# EAGLE design schema actuator (EAGLE 6.4)
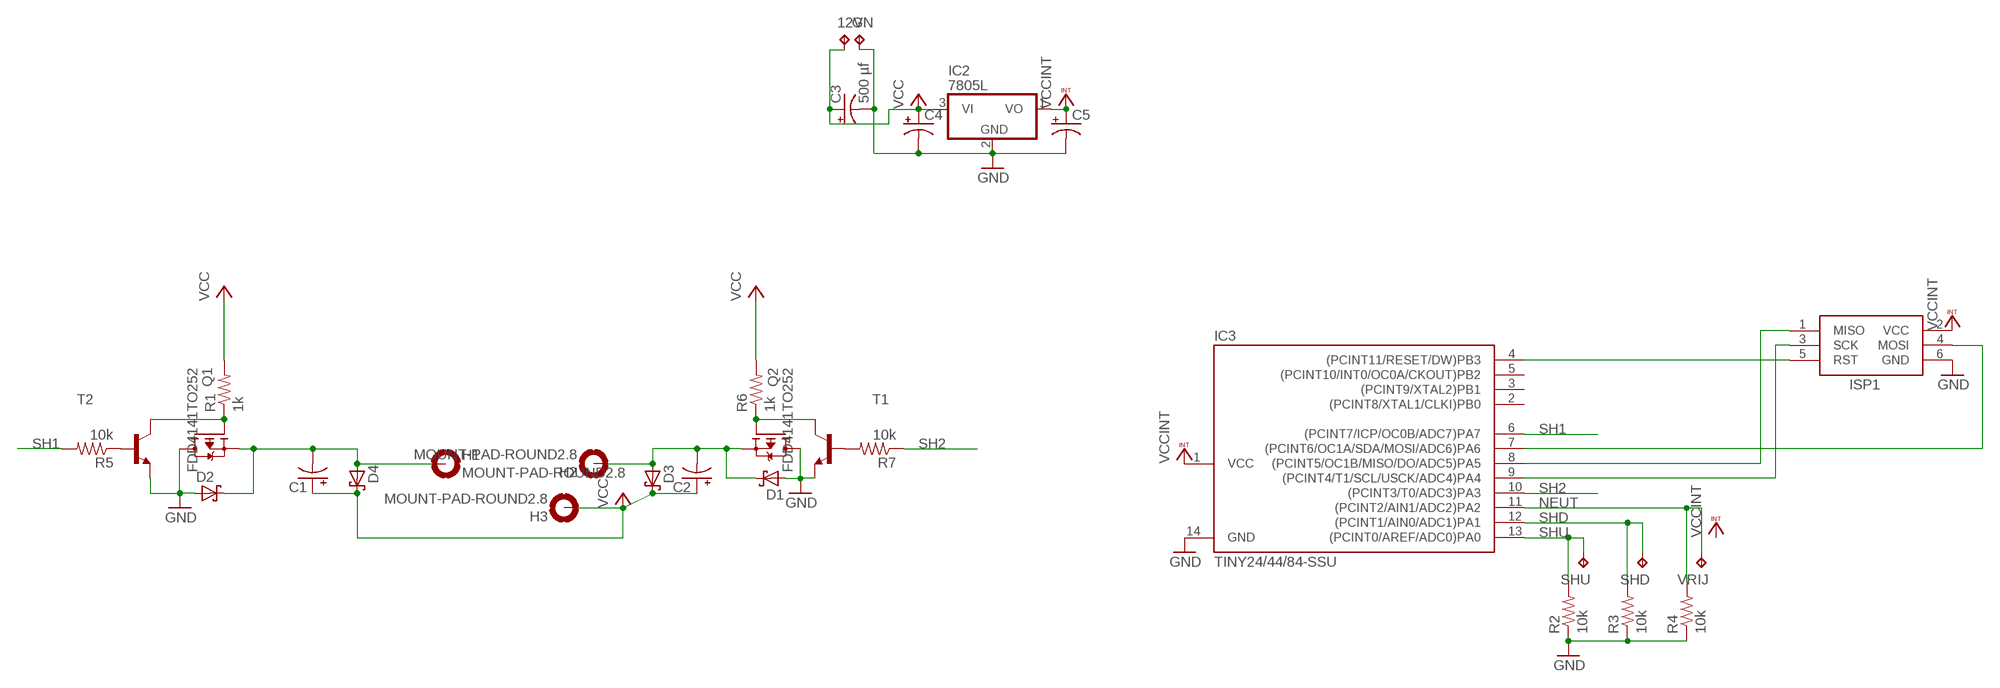
[diagram p0: schematic, sheet 1]

## Parts
12V  TPPAD1-20Y  [P1-20Y]
C1  CPOL-USD  [PANASONIC_D]
C2  CPOL-USD  [PANASONIC_D]
C3  500 µf  CPOL-USG  [PANASONIC_G]
C4  CPOL-USD  [PANASONIC_D]
C5  CPOL-USD  [PANASONIC_D]
D1  SCHOTTKY-DIODEDO41  [DO41-10]
D2  SCHOTTKY-DIODEDO41  [DO41-10]
D3  SCHOTTKY-DIODEDO41  [DO41-10]
D4  SCHOTTKY-DIODEDO41  [DO41-10]
GN  TPPAD1-20Y  [P1-20Y]
H1  MOUNT-PAD-ROUND2.8  [2,8-PAD]
H2  MOUNT-PAD-ROUND2.8  [2,8-PAD]
H3  MOUNT-PAD-ROUND2.8  [2,8-PAD]
IC2  7805L  [TO92]
IC3  TINY24/44/84-SSU  [SOIC14]
ISP1  AVRISP-6  [AVRISP]
Q1  FDD4141TO252  [TO252]
Q2  FDD4141TO252  [TO252]
R1  1k  R-US_R1206  [R1206]
R2  10k  R-US_R1206  [R1206]
R3  10k  R-US_R1206  [R1206]
R4  10k  R-US_R1206  [R1206]
R5  10k  R-US_R1206  [R1206]
R6  1k  R-US_R1206  [R1206]
R7  10k  R-US_R1206  [R1206]
SHD  TPPAD1-20Y  [P1-20Y]
SHU  TPPAD1-20Y  [P1-20Y]
T1  BC817-40-NPN-SOT23-BEC  [SOT23-BEC]
T2  BC817-40-NPN-SOT23-BEC  [SOT23-BEC]
VRIJ  TPPAD1-20Y  [P1-20Y]

## Nets
GND: C3.- C4.- C5.- D1.A D2.A GN.TP IC2.2(GND) IC3.14(GND) ISP1.6(GND) Q1.3(D) Q2.3(D) R2.1 R3.1 R4.1 T1.E T2.E
N$1: C2.- D1.C D3.A H2.B2,8(MOUNT) Q2.2(S)
N$2: Q1.1(G) R1.1 T2.C
N$3: Q2.1(G) R6.1 T1.C
N$4: R5.1 T2.B
N$5: C1.- D2.C D4.A H1.B2,8(MOUNT) Q1.2(S)
N$6: R7.2 T1.B
N$8: IC3.7((PCINT6/OC1A/SDA/MOSI/ADC6)PA6) ISP1.4(MOSI)
N$10: IC3.4((PCINT11/RESET/DW)PB3) ISP1.5(RST)
N$11: IC3.9((PCINT4/T1/SCL/USCK/ADC4)PA4) ISP1.3(SCK)
N$12: IC3.8((PCINT5/OC1B/MISO/DO/ADC5)PA5) ISP1.1(MISO)
NEUT: IC3.11((PCINT2/AIN1/ADC2)PA2) R4.2 VRIJ.TP
SH1: IC3.6((PCINT7/ICP/OC0B/ADC7)PA7) R5.2
SH2: IC3.10((PCINT3/T0/ADC3)PA3) R7.1
SHD: IC3.12((PCINT1/AIN0/ADC1)PA1) R3.2 SHD.TP
SHU: IC3.13((PCINT0/AREF/ADC0)PA0) R2.2 SHU.TP
VCC: 12V.TP C1.+ C2.+ C3.+ C4.+ D3.C D4.C H3.B2,8(MOUNT) IC2.3(VI) R1.2 R6.2
VCCINT: C5.+ IC2.1(VO) IC3.1(VCC) ISP1.2(VCC)
Unconnected: IC3.2((PCINT8/XTAL1/CLKI)PB0) IC3.3((PCINT9/XTAL2)PB1) IC3.5((PCINT10/INT0/OC0A/CKOUT)PB2)

## Library data of the parts
12V GN SHD SHU VRIJ = testpad:TP: Test pad
C1-C5 = adafruit:CPOL-US: POLARIZED CAPACITOR, American symbol
D1-D4 = adafruit:SCHOTTKY-DIODE: Schottky Diode
H1-H3 = holes:MOUNT-PAD-ROUND: MOUNTING PAD, round
IC2 = adafruit:78*: Positive VOLTAGE REGULATOR Added bigger pads to the TO-92 package
IC3 = avr-7:TINY24/44/84
ISP1 = adafruit:AVRISP: AVR ISP HEADER Standard 6 pin header for AVR programming
Q1 Q2 = transistor-fet:FDD4141: P-Channel PowerTrench® MOSFET Source: FDD4141.pdf
R1-R7 = adafruit:R-US_: RESISTOR, American symbol
T1 T2 = transistor:*-NPN-: NPN Transistror BF959 corrected 2008.03.06

## Board
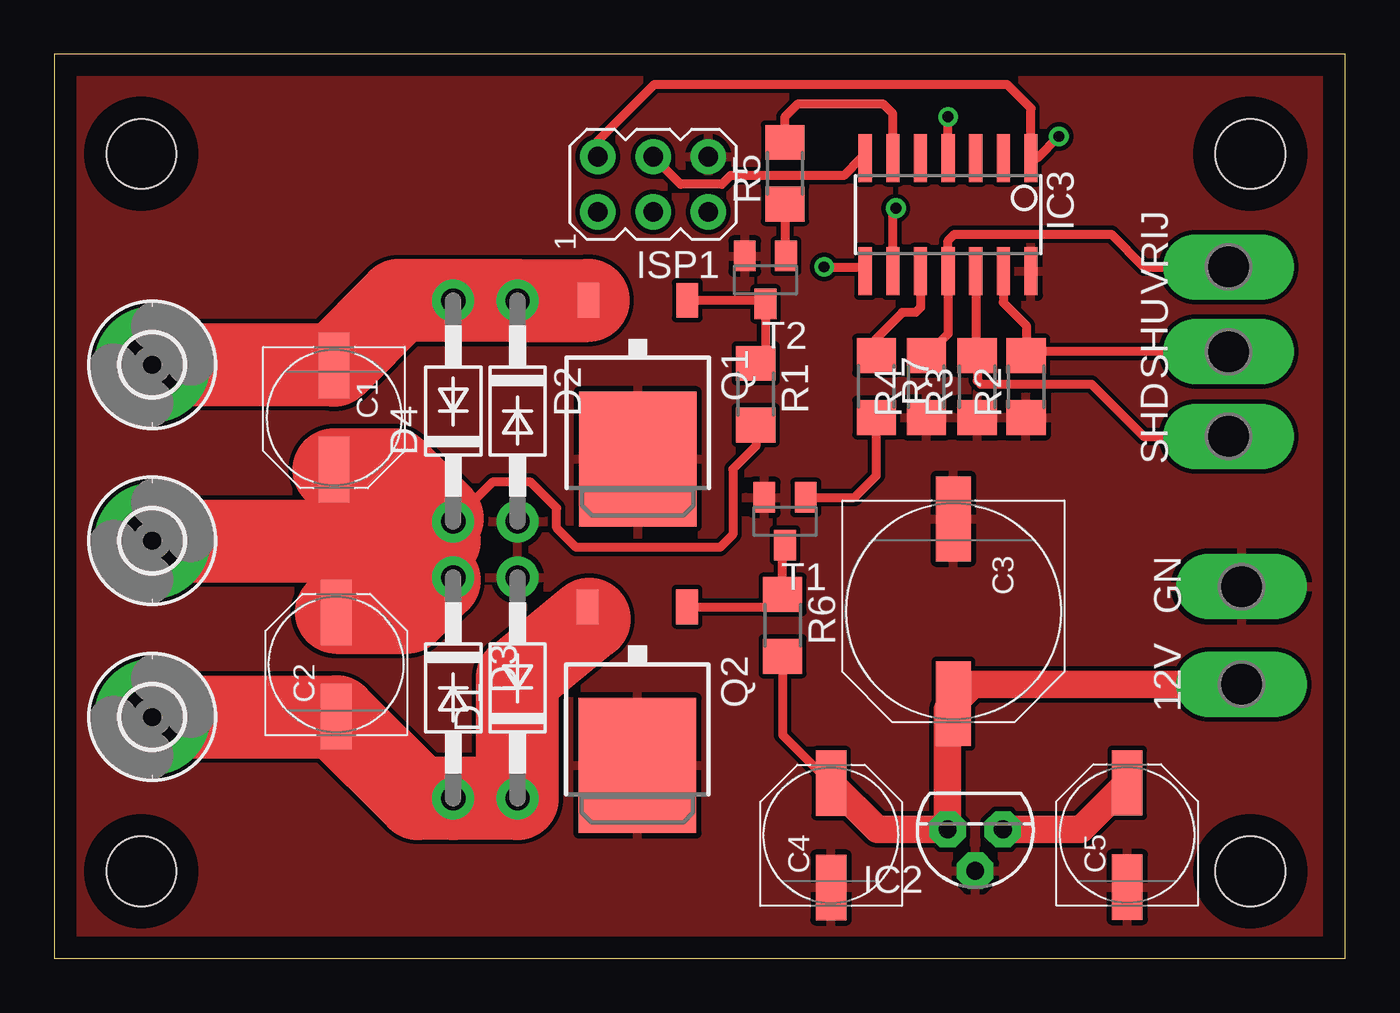
[diagram p1: board, top side]
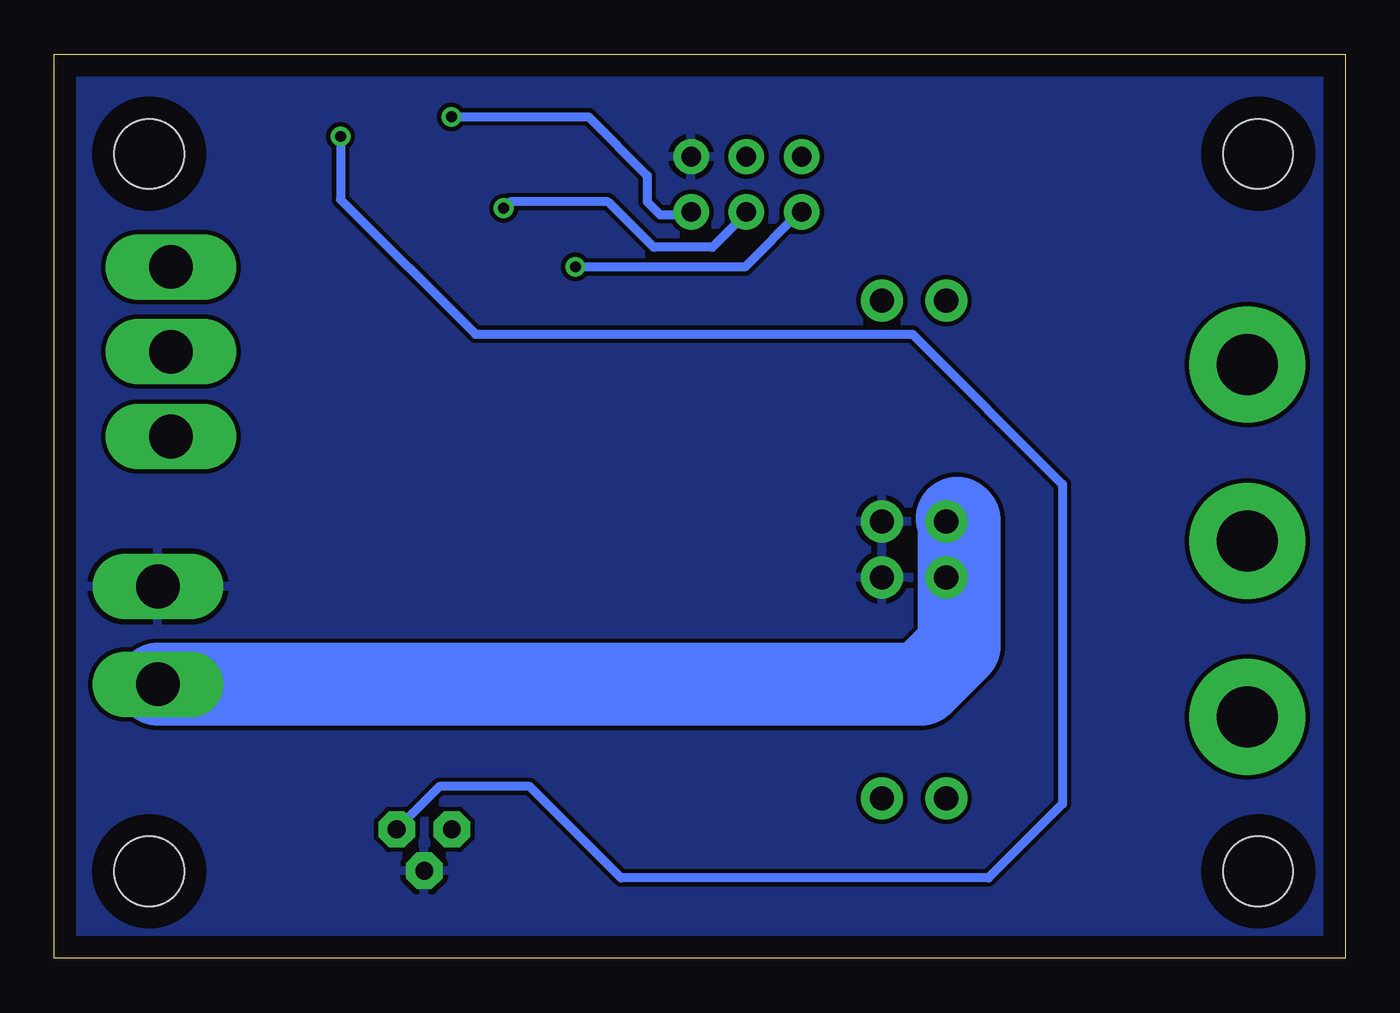
[diagram p2: board, bottom side, seen from below]

Size 59.36 x 41.58 mm. Coordinates in mm from the lower left corner, seen from the top.
Outline: 0,0 59.36,0 59.36,41.58 0,41.58 0,0
Copper layers (1*16): Top 0.035mm / dielectric 1.5mm / Bottom 0.035mm
Design rules "default *": minimum track width 10mil, minimum drill 10mil, track to track 8mil, track to pad 8mil, pad to pad 8mil, via to via 8mil, smd to smd 8mil, copper to edge 40mil, drill to drill 8mil, minimum pad ring 10mil, minimum via ring 8mil, stop-mask expansion 4mil, vias tented up to drill 0mil, thermal gap 10mil
Holes 3.2 mm at 4,37 4,4 55,4 55,37

### Footprints (pad centres in the part's own frame; a part is rotated, then mirrored left to right if it is on the bottom)
P1-20Y = drill 2.007 pad 2.54 long: TP 0,0
PANASONIC_D = smd 3 x 1.4: + 2.4,0; - -2.4,0
PANASONIC_G = smd 3.9 x 1.6: + 4.25,0; - -4.25,0
DO41-10 = drill 1.118 pad 1.93: A 5.08,0; C -5.08,0
2,8-PAD = drill 2.8 pad 5.334: B2,8 0,0
TO92 = drill 0.813 pad 1.676 octagon: 1 -1.27,0; 2 0,1.905; 3 1.27,0
SOIC14 = smd 0.61 x 2.21: 1 -3.81,-2.603; 2 -2.54,-2.603; 3 -1.27,-2.603; 4 0,-2.603; 5 1.27,-2.603; 6 2.54,-2.603; 7 3.81,-2.603; 8 3.81,2.603; 9 2.54,2.603; 10 1.27,2.603; 11 0,2.603; 12 -1.27,2.603; 13 -2.54,2.603; 14 -3.81,2.603
AVRISP = drill 0.9 pad 1.626: 1 -1.27,2.54; 2 1.27,2.54; 3 -1.27,0; 4 1.27,0; 5 -1.27,-2.54; 6 1.27,-2.54
TO252 = smd 1 x 1.6: 1 -2.28,-4.8; 2 2.28,-4.8 | smd 5.4 x 6.2: 3 0,2.5
R1206 = smd 1.6 x 1.803: 1 -1.422,0; 2 1.422,0
SOT23-BEC = smd 1 x 1.4: B -0.95,-1.1; C 0,1.1; E 0.95,-1.1

### Placement (x,y rotation side)
12V  54.6,12.6 90 top
C1  12.86,24.87 270 top
C2  12.96,13.51 90 top
C3  41.34,15.96 270 top
C4  35.72,5.66 90 top
C5  49.34,5.67 90 top
D1  21.3,12.44 90 top
D2  21.3,25.17 270 top
D3  18.34,12.44 270 top
D4  18.34,25.17 90 top
GN  54.6,17.1 90 top
H1  4.5,27.3 0 top
H2  4.5,11.1 0 top
H3  4.5,19.2 0 top
IC2  42.35,5.93 180 top
IC3  41.1,34.2 180 top
ISP1  27.54,35.6 90 top
Q1  26.83,25.46 180 top
Q2  26.82,11.37 180 top
R1  32.26,25.95 270 top
R2  44.69,26.3 90 top
R3  42.44,26.3 90 top
R4  40.1,26.3 90 top
R5  33.6,36.1 90 top
R6  33.49,15.31 270 top
R7  37.8,26.3 270 top
SHD  54,24 90 top
SHU  54,27.9 90 top
T1  33.6,20.1 180 top
T2  32.7,31.2 180 top
VRIJ  54,31.8 90 top

### Tracks (layer width: path | path; a pad name or v marks a point on that pad's centre or on a via)
GND
  pour Bottom: 0,41.6 59.3,41.6 59.3,0 0,0
  pour Top: 0,41.6 59.3,41.6 59.3,0 0,0
N$1
  Top 0.406: 24.6,15.6 24.6,16.1 Q2.2
  Top 3.81: H2.B2,8 C2.- 16.72,7.36 D3.A D1.C 21.3,12.9 24.6,15.6
N$2
  Top 0.406: Q1.1 32.53,30.27 T2.C 32.7,27.81 R1.1
N$3
  Top 0.406: Q2.1 32.92,16.16 R6.1 33.49,18.89 T1.C
N$4
  Top 0.406: R5.1 33.6,32.35 T2.B
N$5
  Top 3.81: H1.B2,8 12.83,27.3 C1.- 15.84,30.25 D4.A D2.C 24.54,30.25 Q1.2
N$6
  Top 0.406: T1.B 36.8,21.2 37.8,22.2 R7.2
N$8
  Top 0.406: IC3.7 37.1,36.8 36.3,36 31.1,36 30.7,35.6 28.8,35.6 ISP1.4
N$10  (via drill 0.5 pad 0.81)
  Top 0.406: IC3.4 v41.1,38.7
  Bottom 0.406: v41.1,38.7 34.8,38.7 32.1,36 32.1,34.8 31.5,34.2 30.2,34.2 ISP1.5
N$11  (via drill 0.5 pad 0.81)
  Top 0.406: IC3.9 38.56,34.36 v38.7,34.5
  Bottom 0.406: ISP1.3 27.54,34.27 29.1,32.7 31.8,32.7 33.9,34.8 38.4,34.8 v38.7,34.5
N$12  (via drill 0.5 pad 0.81)
  Top 0.406: v35.4,31.8 37.09,31.8 IC3.8
  Bottom 0.406: ISP1.1 25.07,34.33 27.6,31.8 v35.4,31.8
NEUT
  Top 0.406: R4.2 41.1,28.72 IC3.11 41.1,33 41.4,33.3 48.6,33.3 50.1,31.8 VRIJ.TP
SH1
  Top 0.406: R5.2 33.6,38.7 34.2,39.3 38.1,39.3 38.56,38.84 IC3.6
SH2
  Top 0.406: R7.1 37.8,28.5 39,29.7 39.6,29.7 39.83,29.93 IC3.10
SHD
  Top 0.406: IC3.12 42.37,27.79 R3.2 42.44,26.56 42.6,26.4 47.7,26.4 50.1,24 SHD.TP
SHU
  Top 0.406: IC3.13 43.64,30.16 44.7,29.1 44.7,27.73 R2.2 44.87,27.9 SHU.TP
VCC
  Top 0.406: R6.2 33.49,10.29 C4.+ | R1.2 32.26,23.55 31.2,22.5 31.2,19.5 30.6,18.9 24,18.9 23.1,19.8 23.1,20.7 21.9,21.9 20.16,21.9 D4.C
  Top 1.27: C4.+ 37.84,5.93 IC2.3 41.08,11.45 C3.+ 42.23,12.6 12V.TP | 18.34,19.2 D4.C 18.05,19.8 17.75,19.8 18.05,20.1 18.3,20.1 18.15,20.25 17.85,20.25
  Top 1.778: 18.34,18.9 D3.C 18.23,17.4 17.7,17.4 | 18.34,18.9 18.34,19.2 18.05,19.2 | 17.7,19.2 18.05,19.2 | 18.05,19.2 18.34,18.9
  Top 3.81: C2.+ 16.21,15.91 17.7,17.4 | C1.+ 15.63,22.47 17.85,20.25 | H3.B2,8 17.7,19.2
  Bottom 1.27: D4.C 18.01,20.09 17.85,20.25
  Bottom 3.81: 12V.TP 19.5,12.6 17.75,14.36 17.75,20.14 17.85,20.25
VCCINT  (via drill 0.5 pad 0.81)
  Top 0.406: ISP1.2 25,37.59 27.6,40.2 43.8,40.2 44.91,39.09 IC3.1 45.2,36.8 v46.2,37.8
  Top 1.27: IC2.1 47.2,5.93 C5.+
  Bottom 0.406: v46.2,37.8 46.2,34.9 40,28.7 19.9,28.7 13,21.8 13,7.1 16.4,3.7 33.3,3.7 37.5,7.9 41.65,7.9 IC2.1